# Altium schematic sheet Sheet4.SchDoc
size A4
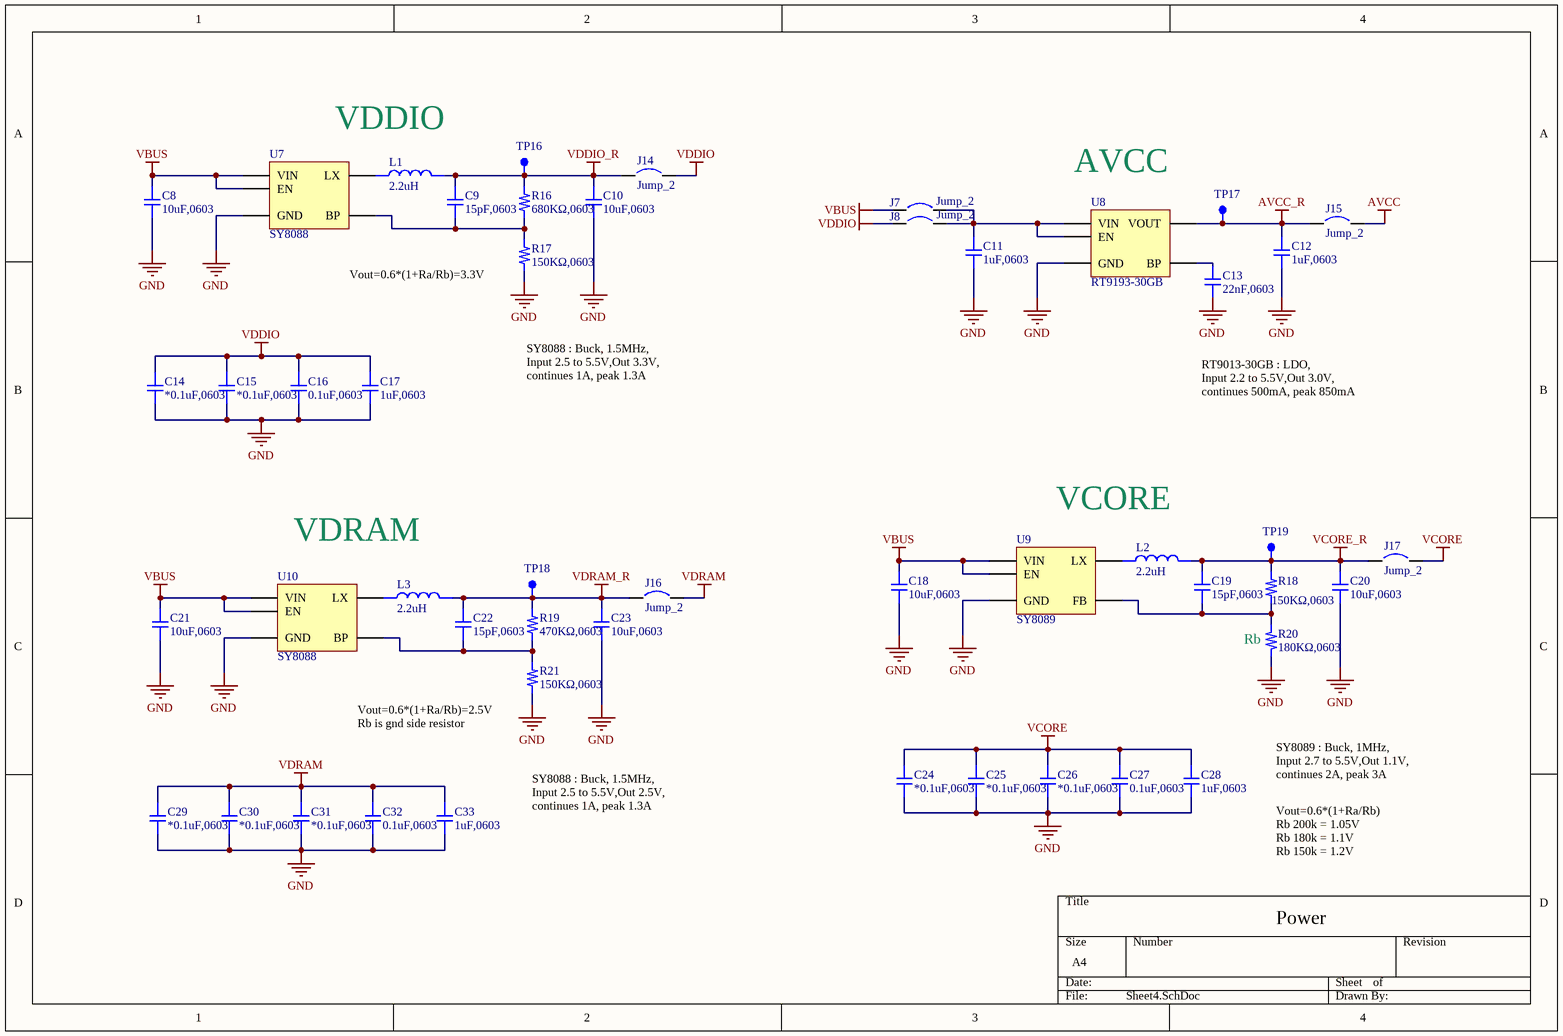
[diagram p0: Sheet4.SchDoc]

## Parts
C8  10uF,0603  [C0603]
C9  15pF,0603  [C0603]
C10  10uF,0603  [C0603]
C11  1uF,0603  [C0603]
C12  1uF,0603  [C0603]
C13  22nF,0603  [C0603]
C14  *0.1uF,0603  [C0603]
C15  *0.1uF,0603  [C0603]
C16  0.1uF,0603  [C0603]
C17  1uF,0603  [C0603]
C18  10uF,0603  [C0603]
C19  15pF,0603  [C0603]
C20  10uF,0603  [C0603]
C21  10uF,0603  [C0603]
C22  15pF,0603  [C0603]
C23  10uF,0603  [C0603]
C24  *0.1uF,0603  [C0603]
C25  *0.1uF,0603  [C0603]
C26  *0.1uF,0603  [C0603]
C27  0.1uF,0603  [C0603]
C28  1uF,0603  [C0603]
C29  *0.1uF,0603  [C0603]
C30  *0.1uF,0603  [C0603]
C31  *0.1uF,0603  [C0603]
C32  0.1uF,0603  [C0603]
C33  1uF,0603  [C0603]
J7  Jump_2  [Jp_small]
J8  Jump_2  [Jp_small]
J14  Jump_2  [power_jump]
J15  Jump_2  [power_jump]
J16  Jump_2  [power_jump]
J17  Jump_2  [power_jump]
L1  2.2uH  [IND_252010_SMD]
L2  2.2uH  [IND_252010_SMD]
L3  2.2uH  [IND_252010_SMD]
R16  680KΩ,0603  [R0603]
R17  150KΩ,0603  [R0603]
R18  150KΩ,0603  [R0603]
R19  470KΩ,0603  [R0603]
R20  180KΩ,0603  [R0603]
R21  150KΩ,0603  [R0603]
TP16  TP  [TP]  (value not drawn)
TP17  TP  [TP]  (value not drawn)
TP18  TP  [TP]  (value not drawn)
TP19  TP  [TP]  (value not drawn)
U7  SY8088  [SOT-23-5p]
U8  RT9193-30GB  [SOT-23-5p]
U9  SY8089  [SOT-23-5p]
U10  SY8088  [SOT-23-5p]

## Nets
AVCC: J15.02
AVCC_R: C12.02 J15.01 TP17.01 U8.05(VOUT)
GND: C8.02 C10.01 C11.02 C12.01 C13.01 C14.01 C15.01 C16.01 C17.01 C18.02 C20.01 C21.02 C23.01 C24.01 C25.01 C26.01 C27.01 C28.01 C29.01 C30.01 C31.01 C32.01 C33.01 R17.01 R20.01 R21.01 U7.02(GND) U8.02(GND) U9.02(GND) U10.02(GND)
VBUS: C8.01 C18.01 C21.01 J7.01 U7.01(EN) U7.04(VIN) U9.01(EN) U9.04(VIN) U10.01(EN) U10.04(VIN)
VCORE: C24.02 C25.02 C26.02 C27.02 C28.02 J17.02
VCORE_R: C19.02 C20.02 J17.01 L2.02 R18.02 TP19.01
VDDIO: C14.02 C15.02 C16.02 C17.02 J8.01 J14.02
VDDIO_R: C9.02 C10.02 J14.01 L1.02 R16.02 TP16.01
VDRAM: C29.02 C30.02 C31.02 C32.02 C33.02 J16.02
VDRAM_R: C22.02 C23.02 J16.01 L3.02 R19.02 TP18.01
NetC9_01: C9.01 R16.01 R17.02 U7.05(BP)
NetC11_01: C11.01 J7.02 J8.02 U8.01(VIN) U8.03(EN)
NetC13_02: C13.02 U8.04(BP)
NetC19_01: C19.01 R18.01 R20.02 U9.05(FB)
NetC22_01: C22.01 R19.01 R21.02 U10.05(BP)
NetL1_01: L1.01 U7.03(LX)
NetL2_01: L2.01 U9.03(LX)
NetL3_01: L3.01 U10.03(LX)

## Notes on the sheet
- VDDIO
- (near U8) AVCC
- Vout=0.6*(1+Ra/Rb)=3.3V
- SY8088 : Buck, 1.5MHz,
  Input 2.5 to 5.5V,Out 3.3V,
  continues 1A, peak 1.3A
- RT9013-30GB : LDO,
  Input 2.2 to 5.5V,Out 3.0V,
  continues 500mA, peak 850mA
- VCORE
- VDRAM
- (near R20) Rb
- (near R21) Vout=0.6*(1+Ra/Rb)=2.5V
  Rb is gnd side resistor
- SY8088 : Buck, 1.5MHz,
  Input 2.5 to 5.5V,Out 2.5V,
  continues 1A, peak 1.3A
- SY8089 : Buck, 1MHz,
  Input 2.7 to 5.5V,Out 1.1V,
  continues 2A, peak 3A
- Vout=0.6*(1+Ra/Rb)
  Rb 200k = 1.05V
  Rb 180k = 1.1V
  Rb 150k = 1.2V
- Power

## Library data of the parts
C8-C33 = Cap
L1-L3 = Ind
R16-R21 = Res